# EasyEDA schematic easyeda.json
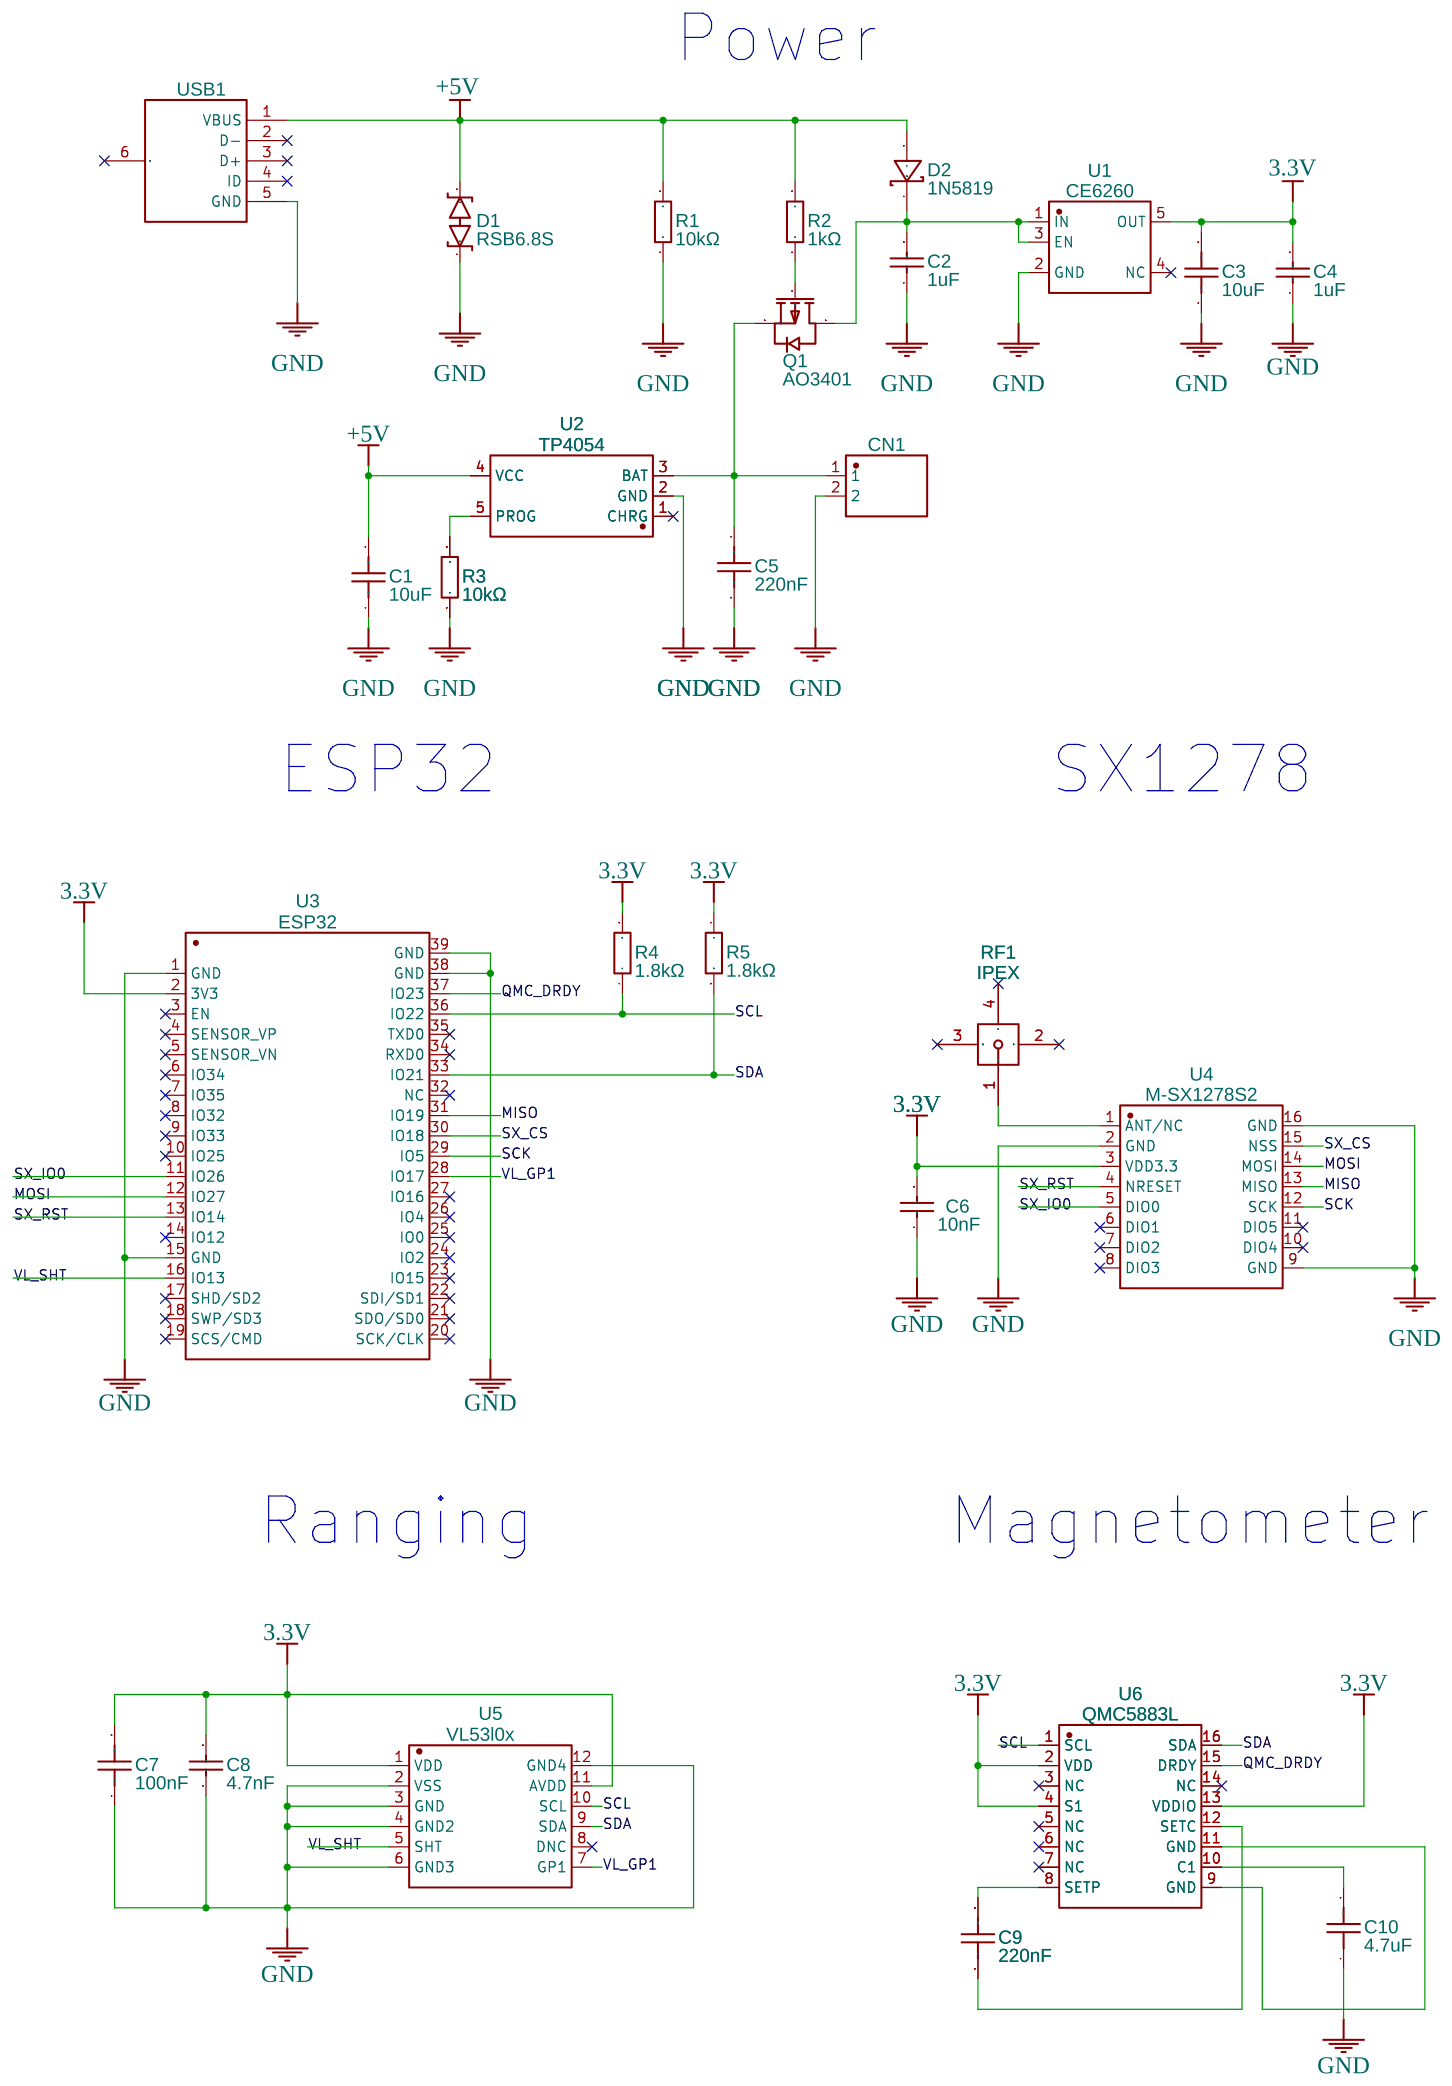
[diagram p0: schematic sheet]

## Parts
C1  10uF  [C0603]
C2  1uF  [C0402]
C3  10uF  [C0603]
C4  1uF  [C0402]
C5  220nF  [C0402]
C6  10nF  [C0603]
C7  100nF  [C0603]
C8  4.7nF  [C0603]
C9  220nF  [C0402]
C10  4.7uF  [C0402]
CN1  B2B-XH-A (LF)(SN)  [CONN-TH_B2B-XH-A-LF-SN]
D1  RSB6.8S  [SOD-523_L1.2-W0.8-LS1.6-BI]
D2  1N5819  [SMA_L4.4-W2.6-LS5.0-RD]
Q1  AO3401  [SOT-23-3_L2.9-W1.6-P1.90-LS2.8-BR]
R1  10kΩ  [R0402]
R2  1kΩ  [R0402]
R3  10kΩ  [R0402]
R4  1.8kΩ  [R0402]
R5  1.8kΩ  [R0402]
RF1  IPEX  [IPEX-SMD_4P-L1.8-W1.7-LS2.0]
U1  CE6260  [SOT23-5]
U2  TP4054  [SOT-23-5_L3.0-W1.7-P0.95-LS2.8-BL]
U3  ESP32  [WIFIM-SMD_ESP32-WROOM-32-N4]
U4  M-SX1278S2  [WIRELM-SMD_M-SX1278S2]
U5  VL53l0x  [OPTO-SMD_12P_VL53L0CXV0DH-1]
U6  QMC5883L  [LGA-16_L3.0-W3.0-P0.50-BL_SQ]
USB1  U254-051T-4BH83-S1S  [MICRO-USB-SMD_U254-051T-4BH83-S1S]

## Library data of the parts
C1 C3 = CL10A106KP8NNNC: Supplier: LCSC; Manufacturer: SAMSUNG(三星); Supplier Part: C19702; JLCPCB Part Class: Basic Part; link: https://lcsc.com/eda_search?q=C19702&%26type=1&ref=editor
C2 C4 = CL05A105KP5NNNC: Supplier: LCSC; Manufacturer: SAMSUNG(三星); Supplier Part: C14445; JLCPCB Part Class: Extended Part; link: https://lcsc.com/eda_search?q=C14445&%26type=1&ref=editor
C5 = CL05A224KP5NNNC: Contributor: LCSC; Supplier: LCSC; Manufacturer: SAMSUNG(三星); Supplier Part: C160829; JLCPCB Part Class: Extended Part; link: https://lcsc.com/eda_search?q=C160829&%26type=1&ref=editor
C6 = CL10B103KB8NNNC: Supplier: LCSC; Manufacturer: SAMSUNG(三星); Supplier Part: C1589; JLCPCB Part Class: Extended Part; link: https://lcsc.com/eda_search?q=C1589&%26type=1&ref=editor
C7 = CL10B104KB8NNNC: Supplier: LCSC; Manufacturer: SAMSUNG(三星); Supplier Part: C1591; JLCPCB Part Class: Extended Part; link: https://lcsc.com/eda_search?q=C1591&%26type=1&ref=editor
C8 = CL10B472KB8NNNC: Supplier: LCSC; Manufacturer: SAMSUNG(三星); Supplier Part: C1621; JLCPCB Part Class: Extended Part; link: https://lcsc.com/eda_search?q=C1621&%26type=1&ref=editor
C9 = CGA2B1X7R1A224K050BC: Contributor: lcsc; Supplier: LCSC; Supplier Part: C193128; Manufacturer: TDK; link: https://lcsc.com/eda_search?q=C193128&%26type=1&ref=editor
C10 = CL05A475MQ5NRNC_C307423: Contributor: LCSC; Supplier: LCSC; Supplier Part: C307423; Manufacturer: SAMSUNG(三星); Manufacturer Part: CL05A475MQ5NRNC; JLCPCB Part Class: Extended Part; link: https://lcsc.com/eda_search?q=C307423&%26type=1&ref=editor
CN1 = B2B-XH-A (LF)(SN): Contributor: LCSC; Supplier: LCSC; Supplier Part: C158012; Manufacturer: JST; Manufacturer Part: B2B-XH-A(LF)(SN); JLCPCB Part Class: Extended Part; link: https://lcsc.com/eda_search?q=C158012&%26type=1&ref=editor
D1 = RSB6.8S: Contributor: LCSC; Supplier: LCSC; Supplier Part: C239153; Manufacturer: null; JLCPCB Part Class: Extended Part; link: https://lcsc.com/eda_search?q=C239153&%26type=1&ref=editor
D2 = 1N5819_C437199: Contributor: LCSC; Supplier: LCSC; Supplier Part: C437199; Manufacturer: KEXIN(科信); JLCPCB Part Class: Extended Part; link: https://lcsc.com/eda_search?q=C437199&%26type=1&ref=editor
Q1 = AO3401_C2891730: Contributor: LCSC; Supplier: LCSC; Supplier Part: C2891730; Manufacturer: YONGYUTAI(永裕泰); JLCPCB Part Class: Extended Part; link: https://lcsc.com/eda_search?q=C2891730&%26type=1&ref=editor
R1 R3 = 0402WGF1002TCE: Supplier: LCSC; Manufacturer: UNI-ROYAL(厚声); Supplier Part: C25744; JLCPCB Part Class: Basic Part; link: https://lcsc.com/eda_search?q=C25744&%26type=1&ref=editor
R2 = 0402WGF1001TCE: Supplier: LCSC; Manufacturer: UNI-ROYAL(厚声); Supplier Part: C11702; JLCPCB Part Class: Basic Part; link: https://lcsc.com/eda_search?q=C11702&%26type=1&ref=editor
R4 R5 = 0402WGF1801TCE: Supplier: LCSC; Manufacturer: UNI-ROYAL(厚声); Supplier Part: C25871; JLCPCB Part Class: Extended Part; link: https://lcsc.com/eda_search?q=C25871&%26type=1&ref=editor
RF1 = IPEX-4: Contributor: lcsc; Supplier: LCSC; Supplier Part: C2987683; Manufacturer: Ziisor(致哲); JLCPCB Part Class: Extended Part; link: https://lcsc.com/eda_search?q=C2987683&%26type=1&ref=editor
U1 = CE6260_LDO Regulator: Contributor: Vicente Garceran Hernandez
U2 = TP4054: sourceId: dx642CAWU; Contributor: kyle.hu.gz; Supplier: LCSC; Manufacturer: TOPPOWER(南京拓微); Manufacturer Part: TP4054-42-SOT25R; Supplier Part: C32574; JLCPCB Part Class: Basic Part; link: https://lcsc.com/eda_search?q=C32574&%26type=1&ref=editor
U3 = ESP32-WROOM-32: Contributor: LCSC; Supplier: LCSC; Supplier Part: C82899; Manufacturer: ESPRESSIF(乐鑫); Manufacturer Part: ESP32-WROOM-32-N4; JLCPCB Part Class: Extended Part; link: https://lcsc.com/eda_search?q=C82899&%26type=1&ref=editor
U4 = M-SX1278S2: Contributor: LCSC; Supplier: LCSC; Supplier Part: C845532; Manufacturer: DreamLNK(骏晔科技); JLCPCB Part Class: Extended Part; link: https://lcsc.com/eda_search?q=C845532&%26type=1&ref=editor
U5 = VL53L0CXV0DH/1: Supplier: LCSC; Manufacturer: ST(意法半导体); Supplier Part: C91199; JLCPCB Part Class: Extended Part; link: https://lcsc.com/eda_search?q=C91199&%26type=1&ref=editor
U6 = QMC5883L: Contributor: LCSC; Supplier: LCSC; Supplier Part: C976032; Manufacturer: QST(上海矽睿); JLCPCB Part Class: Extended Part; link: https://lcsc.com/eda_search?q=C976032&%26type=1&ref=editor
USB1 = U254-051T-4BH83-S1S: Contributor: LCSC; Supplier: LCSC; Supplier Part: C319160; Manufacturer: XKB Connectivity(中国星坤); JLCPCB Part Class: Extended Part; link: https://lcsc.com/eda_search?q=C319160&%26type=1&ref=editor

## Nets
3.3V: C3.2 C4.2 C6.2 C7.2 C8.2 R4.2 R5.1 U1.5(OUT) U3.2(3V3) U4.3(VDD3.3) U5.1(VDD) U5.11(AVDD) U6.2(VDD) U6.4(S1) U6.13(VDDIO)
+5V: C1.2 D1.2 D2.2(A) R1.2 R2.2 U2.4(VCC) USB1.1(VBUS)
GND: C1.1 C2.1 C3.1 C4.1 C5.2 C6.1 C7.1 C8.1 C10.1 CN1.2 D1.1 R1.1 R3.1 U1.2(GND) U2.2(GND) U3.1(GND) U3.15(GND) U3.38(GND) U3.39(GND) U4.2(GND) U4.9(GND) U4.16(GND) U5.2(VSS) U5.3(GND) U5.4(GND2) U5.6(GND3) U5.12(GND4) USB1.5(GND)
MISO: U3.31(IO19) U4.13(MISO)
MOSI: U3.12(IO27) U4.14(MOSI)
QMC_DRDY: U3.37(IO23) U6.15(DRDY)
SCK: U3.29(IO5) U4.12(SCK)
SCL: R4.1 U3.36(IO22) U5.10(SCL) U6.1(SCL)
SDA: R5.2 U3.33(IO21) U5.9(SDA) U6.16(SDA)
SX_CS: U3.30(IO18) U4.15(NSS)
SX_IO0: U3.11(IO26) U4.5(DIO0)
SX_RST: U3.13(IO14) U4.4(NRESET)
VL_GP1: U3.28(IO17) U5.7(GP1)
VL_SHT: U3.16(IO13) U5.5(SHT)
Net-(C2-2): C2.2 D2.1(C) Q1.3(D) U1.1(IN) U1.3(EN)
Net-(C5-1): C5.1 CN1.1 Q1.2(S) U2.3(BAT)
Net-(C9-1): C9.1 U6.12(SETC)
Net-(C9-2): C9.2 U6.8(SETP)
Net-(C10-2): C10.2 U6.10(C1)
Net-(Q1-1): Q1.1(G) R2.1
Net-(R3-2): R3.2 U2.5(PROG)
Net-(RF1-1): RF1.1 U4.1(ANT/NC)
Net-(U6-9): U6.9(GND) U6.11(GND)

Not connected (* = marked no-connect by the designer): RF1 2* 3* 4*; U1 4(NC)*; U2 1(CHRG)*; U3 3(EN)* 4(SENSOR_VP)* 5(SENSOR_VN)* 6(IO34)* 7(IO35)* 8(IO32)* 9(IO33)* 10(IO25)* 14(IO12)* 17(SHD/SD2)* 18(SWP/SD3)* 19(SCS/CMD)* 20(SCK/CLK)* 21(SDO/SD0)* 22(SDI/SD1)* 23(IO15)* 24(IO2)* 25(IO0)* 26(IO4)* 27(IO16)* 32(NC)* 34(RXD0)* 35(TXD0)*; U4 6(DIO1)* 7(DIO2)* 8(DIO3)* 10(DIO4)* 11(DIO5)*; U5 8(DNC)*; U6 3(NC)* 5(NC)* 6(NC)* 7(NC)* 14(NC)*; USB1 2(D-)* 3(D+)* 4(ID)* 6(EH)*

## Notes on the sheet
- Power
- ESP32
- SX1278
- Ranging
- Magnetometer
